# Altium schematic sheet Input_1.SchDoc
size A4
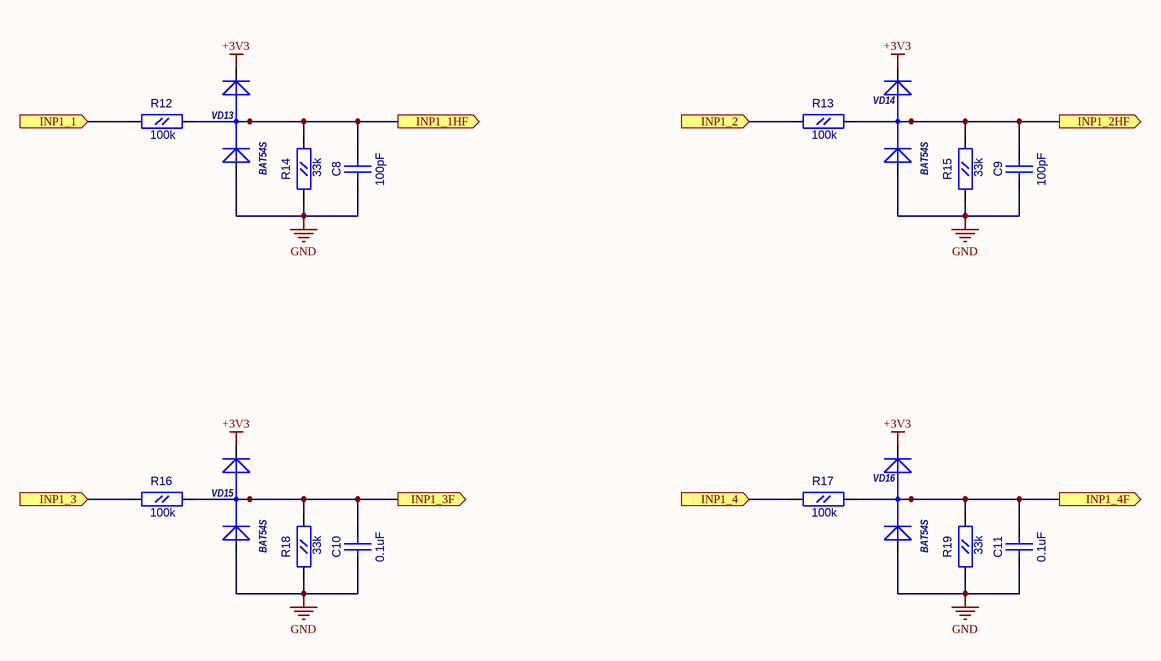
[diagram p0: Input_1.SchDoc]

## Parts
C8  100pF  [CC0603]
C9  100pF  [CC0603]
C10  0.1uF  [CC0603]
C11  0.1uF  [CC0603]
R12  100k  [RC0603]
R13  100k  [RC0603]
R14  33k  [RC0603]
R15  33k  [RC0603]
R16  100k  [RC0603]
R17  100k  [RC0603]
R18  33k  [RC0603]
R19  33k  [RC0603]
VD13  BAT54S  [SOT-23(GSD)]
VD14  BAT54S  [SOT-23(GSD)]
VD15  BAT54S  [SOT-23(GSD)]
VD16  BAT54S  [SOT-23(GSD)]

## Ports
INP1_1 (in), INP1_1HF (out), INP1_2 (in), INP1_2HF (out), INP1_3 (in), INP1_3F (out), INP1_4 (in), INP1_4F (out)

## Nets
+3V3: VD13.2(K) VD14.2(K) VD15.2(K) VD16.2(K)
GND: C8.1(A) C9.1(A) C10.1(A) C11.1(A) R14.1(A) R15.1(A) R18.1(A) R19.1(A) VD13.1(A) VD14.1(A) VD15.1(A) VD16.1(A)
INP1_1: R12.1(A) ; port INP1_1
INP1_1HF: C8.2(B) R12.2(B) R14.2(B) VD13.3(AK) ; port INP1_1HF
INP1_2: R13.1(A) ; port INP1_2
INP1_2HF: C9.2(B) R13.2(B) R15.2(B) VD14.3(AK) ; port INP1_2HF
INP1_3: R16.1(A) ; port INP1_3
INP1_3F: C10.2(B) R16.2(B) R18.2(B) VD15.3(AK) ; port INP1_3F
INP1_4: R17.1(A) ; port INP1_4
INP1_4F: C11.2(B) R17.2(B) R19.2(B) VD16.3(AK) ; port INP1_4F

## Library data of the parts
C8-C11 = CC0603
  C8 C9: Value: 100pF
  C10 C11: Value: 0.1uF
R12-R19 = RC0603
  R12 R13 R16 R17: Value: 100k
  R14 R15 R18 R19: Value: 33k
VD13-VD16 = BAT54S: 1.0 Ampere General Purpose Rectifier; ComponentField6: Published 8-Jun-2000, Modified 11-July-2000: SIM Model Added.; Value: *